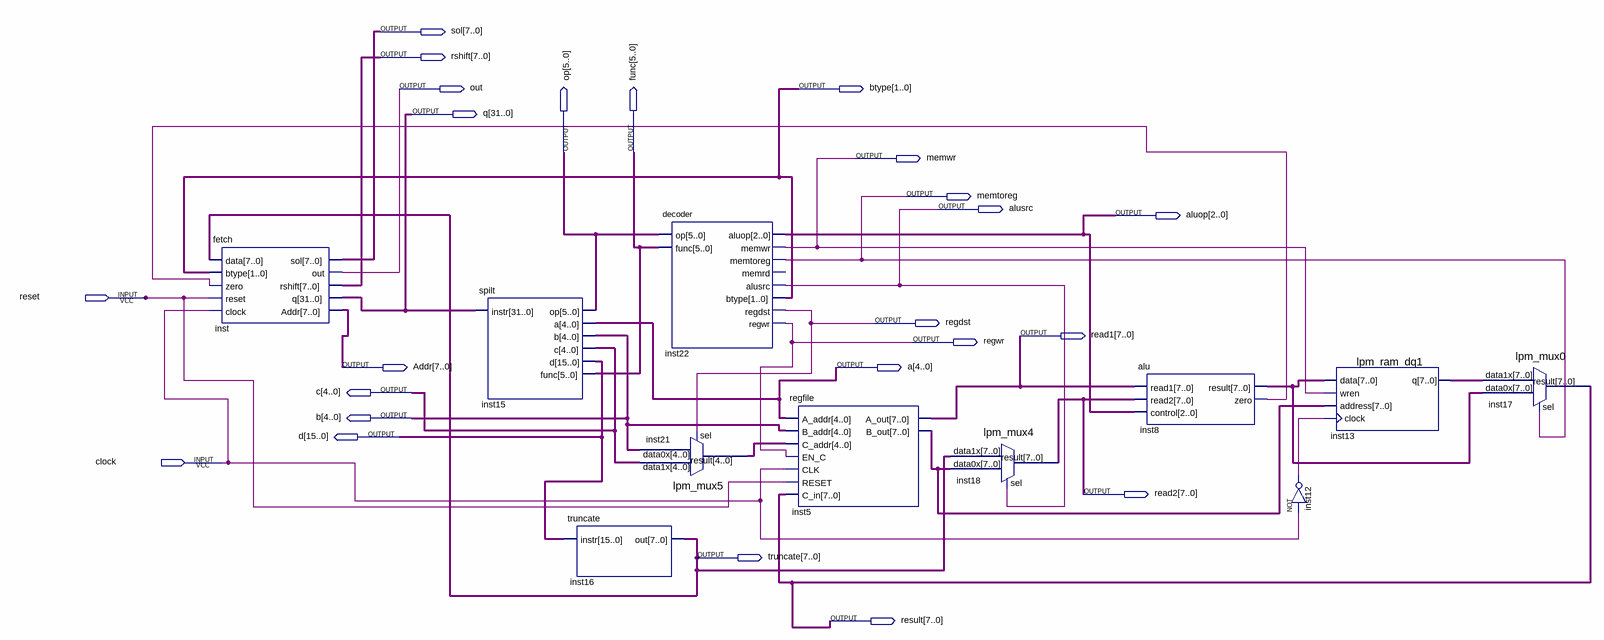
[diagram p0: schematic sheet]
// Quartus schematic Project1.bdf as structural Verilog: 11 symbols, 24 pins
module Project1 (
  input  reset,
  input  clock,
  output [7:0] sol,
  output [7:0] rshift,
  output out,
  output [1:0] btype,
  output [31:0] q,
  output [5:0] op,
  output [5:0] func,
  output memwr,
  output memtoreg,
  output alusrc,
  output [2:0] aluop,
  output regdst,
  output [7:0] read1,
  output regwr,
  output [7:0] Addr,
  output [4:0] a,
  output [4:0] c,
  output [4:0] b,
  output [15:0] d,
  output [7:0] read2,
  output [7:0] truncate,
  output [7:0] result
);

  wire inst8_zero, inst12_out;
  wire [4:0] inst21_result;
  wire [7:0] inst5_b_out, inst8_result, inst13_q;

  fetch inst (
    .data(truncate), .btype(btype), .zero(inst8_zero), .reset(reset), .clock(clock), .sol(sol), .out(out),
    .rshift(rshift), .q(q), .Addr(Addr));
  spilt inst15 (.instr(q), .op(op), .a(a), .b(b), .c(c), .d(d), .func(func));
  truncate inst16 (.instr(d), .out(truncate));
  decoder inst22 (
    .op(op), .func(func), .aluop(aluop), .memwr(memwr), .memtoreg(memtoreg), .alusrc(alusrc), .btype(btype),
    .regdst(regdst), .regwr(regwr));  // open: memrd
  lpm_mux5 inst21 (.data1x(c), .data0x(b), .sel(regdst), .result(inst21_result));
  regfile inst5 (
    .A_addr(a), .B_addr(b), .C_addr(inst21_result), .EN_C(regwr), .CLK(clock), .RESET(reset), .C_in(result),
    .A_out(read1), .B_out(inst5_b_out));
  lpm_mux4 inst18 (.data1x(truncate), .data0x(inst5_b_out), .sel(alusrc), .result(read2));
  alu inst8 (.read1(read1), .read2(read2), .control(aluop), .result(inst8_result), .zero(inst8_zero));
  lpm_ram_dq1 inst13 (.data(inst8_result), .wren(memwr), .address(inst5_b_out), .clock(inst12_out), .q(inst13_q));
  not inst12 (inst12_out, clock);
  lpm_mux0 inst17 (.data1x(inst13_q), .data0x(inst8_result), .sel(memtoreg), .result(result));
endmodule
